# Altium schematic sheet Boost_Bar.SchDoc
size B
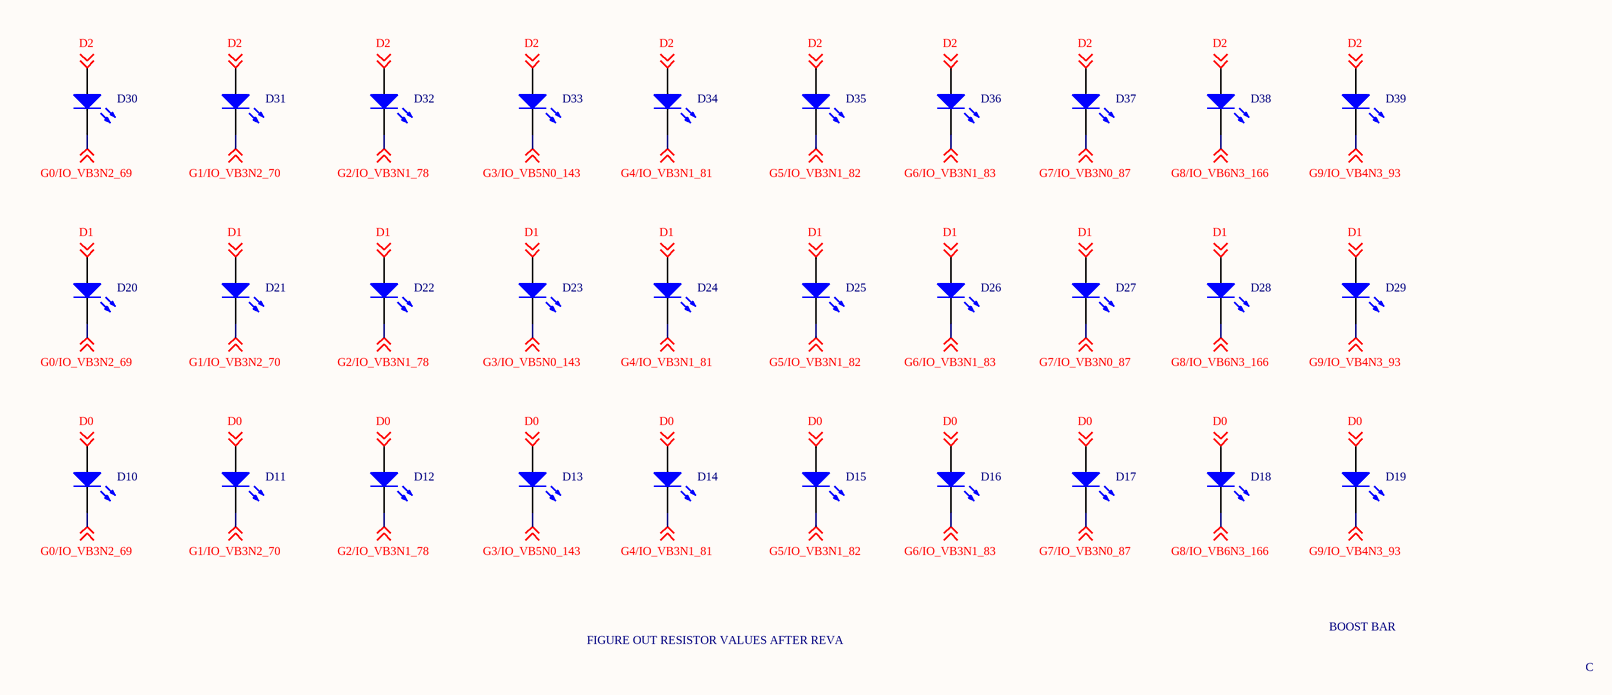
[diagram p0: Boost_Bar.SchDoc]

## Parts
D10  (no value)  [DIODE_0603]
D11  (no value)  [DIODE_0603]
D12  (no value)  [DIODE_0603]
D13  (no value)  [DIODE_0603]
D14  (no value)  [DIODE_0603]
D15  (no value)  [DIODE_0603]
D16  (no value)  [DIODE_0603]
D17  (no value)  [DIODE_0603]
D18  (no value)  [DIODE_0603]
D19  (no value)  [DIODE_0603]
D20  (no value)  [DIODE_0603]
D21  (no value)  [DIODE_0603]
D22  (no value)  [DIODE_0603]
D23  (no value)  [DIODE_0603]
D24  (no value)  [DIODE_0603]
D25  (no value)  [DIODE_0603]
D26  (no value)  [DIODE_0603]
D27  (no value)  [DIODE_0603]
D28  (no value)  [DIODE_0603]
D29  (no value)  [DIODE_0603]
D30  (no value)  [DIODE_0603]
D31  (no value)  [DIODE_0603]
D32  (no value)  [DIODE_0603]
D33  (no value)  [DIODE_0603]
D34  (no value)  [DIODE_0603]
D35  (no value)  [DIODE_0603]
D36  (no value)  [DIODE_0603]
D37  (no value)  [DIODE_0603]
D38  (no value)  [DIODE_0603]
D39  (no value)  [DIODE_0603]

## Nets
D0: D10.1(A) D11.1(A) D12.1(A) D13.1(A) D14.1(A) D15.1(A) D16.1(A) D17.1(A) D18.1(A) D19.1(A) ; off-sheet D0
D1: D20.1(A) D21.1(A) D22.1(A) D23.1(A) D24.1(A) D25.1(A) D26.1(A) D27.1(A) D28.1(A) D29.1(A) ; off-sheet D1
D2: D30.1(A) D31.1(A) D32.1(A) D33.1(A) D34.1(A) D35.1(A) D36.1(A) D37.1(A) D38.1(A) D39.1(A) ; off-sheet D2
G0/IO_VB3N2_69: D10.2(K) D20.2(K) D30.2(K) ; off-sheet G0/IO_VB3N2_69
G1/IO_VB3N2_70: D11.2(K) D21.2(K) D31.2(K) ; off-sheet G1/IO_VB3N2_70
G2/IO_VB3N1_78: D12.2(K) D22.2(K) D32.2(K) ; off-sheet G2/IO_VB3N1_78
G3/IO_VB5N0_143: D13.2(K) D23.2(K) D33.2(K) ; off-sheet G3/IO_VB5N0_143
G4/IO_VB3N1_81: D14.2(K) D24.2(K) D34.2(K) ; off-sheet G4/IO_VB3N1_81
G5/IO_VB3N1_82: D15.2(K) D25.2(K) D35.2(K) ; off-sheet G5/IO_VB3N1_82
G6/IO_VB3N1_83: D16.2(K) D26.2(K) D36.2(K) ; off-sheet G6/IO_VB3N1_83
G7/IO_VB3N0_87: D17.2(K) D27.2(K) D37.2(K) ; off-sheet G7/IO_VB3N0_87
G8/IO_VB6N3_166: D18.2(K) D28.2(K) D38.2(K) ; off-sheet G8/IO_VB6N3_166
G9/IO_VB4N3_93: D19.2(K) D29.2(K) D39.2(K) ; off-sheet G9/IO_VB4N3_93

## Notes on the sheet
- BOOST BAR
- FIGURE OUT RESISTOR VALUES AFTER REVA
- C

## Library data of the parts
D10-D39 = LED0: Typical INFRARED GaAs LED; Published: 8-Jun-2000; LatestRevisionDate: 08-Jul-2005; LatestRevisionNote: Mech Layer 1 removed.; PackageReference: LED-0; Publisher: Altium Limited; PackageDescription: LED; 2 Leads